# Altium schematic sheet ADC_PLL.SchDoc: FIT_PM12 board
size 420 x 297 mm; CheckedBy: G.Kasprowicz; Author: INR Moscow; CompanyName: WUT ISE; DrawnBy: M.Podgórski; Organization: WUT ISE; Address1: PW ISE; Address2: Nowowiejska 15/19 00-665 Warsaw; Address3: gkasprow@gmail.com; DocumentNumber: 6; Revision: 2; SheetNumber: 7; SheetTotal: 21; ModifiedBy: -; CheckedDate: -; Title2: ADC clocking; DivGrp: WUT ISE; Designer: INR RAS; ModifiedDate: -; ProjectName: Sensor Box
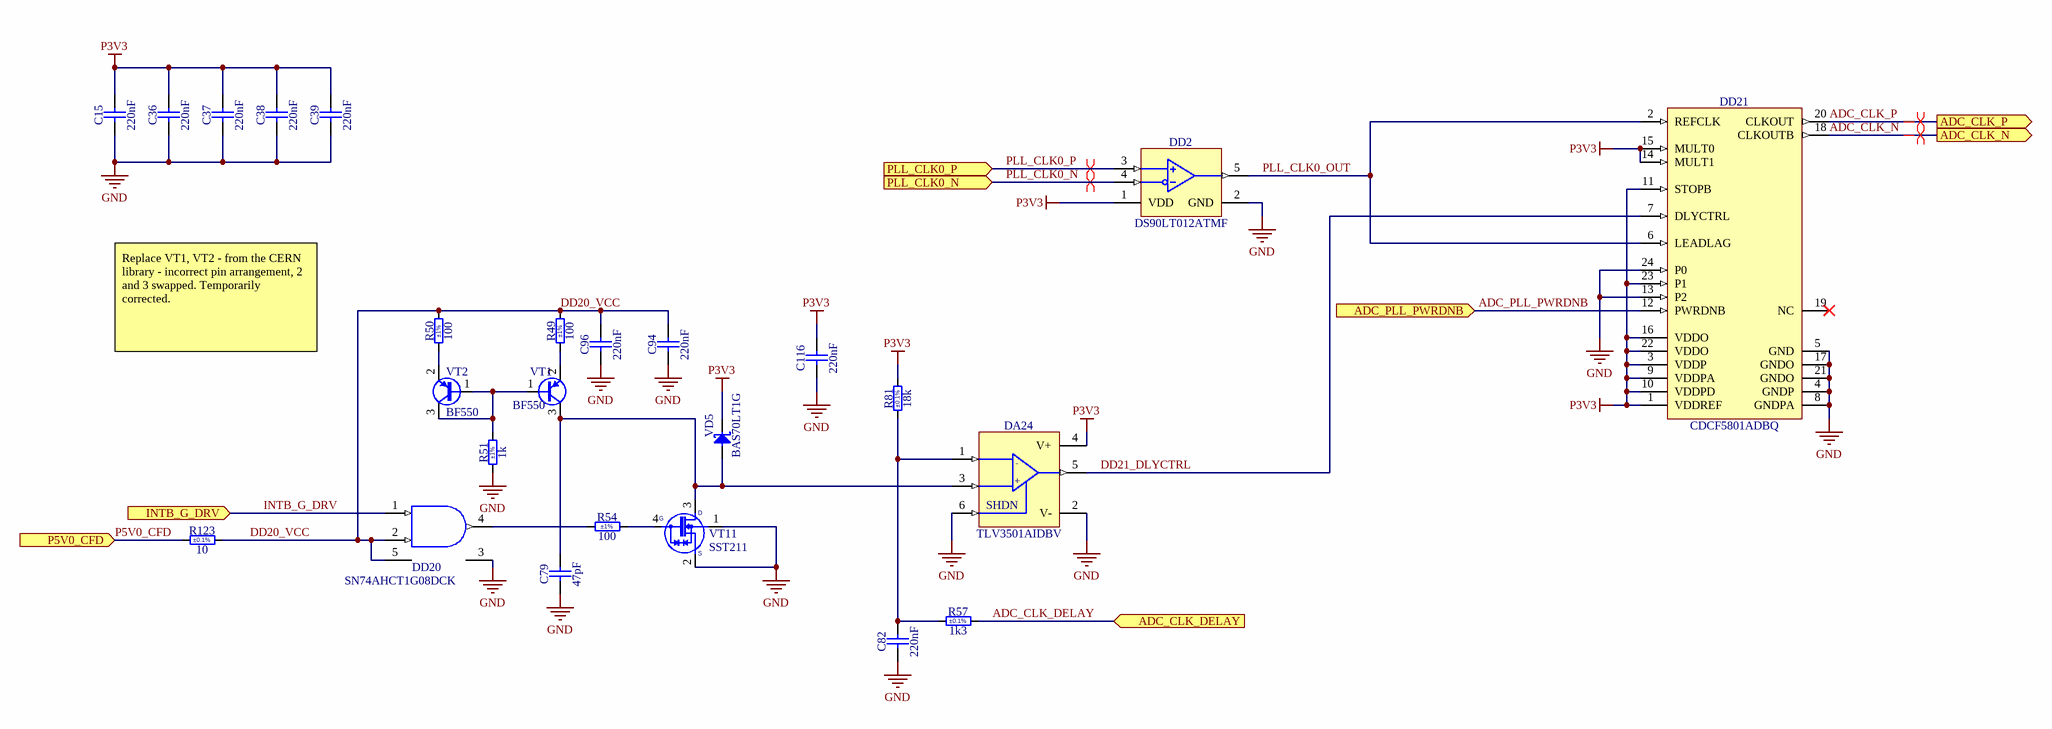
[diagram p0: ADC_PLL.SchDoc]

## Parts
C15  220nF  [CAPC1005X55N]
C36  220nF  [CAPC1005X55N]
C37  220nF  [CAPC1005X55N]
C38  220nF  [CAPC1005X55N]
C39  220nF  [CAPC1005X55N]
C79  47pF  [CAPC2012X140N]
C82  220nF  [CAPC1005X55N]
C94  220nF  [CAPC1005X55N]
C96  220nF  [CAPC1005X55N]
C116  220nF  [CAPC2012X135N]
DA24  TLV3501AIDBV  [SOT95P280X145-6N]
DD2  DS90LT012ATMF  [SOT95P280X145-5N]
DD20  SN74AHCT1G08DCK  [SOT65P210X110-5N]
DD21  CDCF5801ADBQ  [SOP63P600X175-24N]
R49  100  Tolerance: ±1%  [RESC1608X55N]
R50  100  Tolerance: ±1%  [RESC1608X55N]
R51  1k  Tolerance: ±1%  [RESC1005X40N]
R54  100  Tolerance: ±1%  [RESC1608X55N]
R57  1k3  Tolerance: ±0.1%  [RESC2012X60N]
R81  18k  Tolerance: ±0.1%  [RESC2012X60N]
R123  10  Tolerance: ±0.1%  [RESC2012X60N]
VD5  BAS70LT1G  [SOT95P240X110-3N]
VT1  BF550  [SOT95P230X110-3N]
VT2  BF550  [SOT95P230X110-3N]
VT11  SST211  [SOT143N]

## Ports
ADC_CLK_DELAY (in), ADC_CLK_N (out), ADC_CLK_P (out), ADC_PLL_PWRDNB (in), INTB_G_DRV (in), P5V0_CFD (in), PLL_CLK0_N (in), PLL_CLK0_P (in)

## Nets
GND: C15.1 C36.1 C37.1 C38.1 C39.1 C79.1 C82.1 C94.1 C96.1 C116.1 DA24.2(V-) DA24.6(SHDN) DD2.2(GND) DD20.3(GND) DD21.4(GNDP) DD21.5(GND) DD21.8(GNDPA) DD21.13(P2) DD21.17(GNDO) DD21.21(GNDO) DD21.24(P0) R51.1 VT11.1(SUB) VT11.2(S)
P3V3: C15.2 C36.2 C37.2 C38.2 C39.2 C116.2 DA24.4(V+) DD2.1(VDD) DD21.1(VDDREF) DD21.3(VDDP) DD21.9(VDDPA) DD21.10(VDDPD) DD21.11(STOPB) DD21.14(MULT1) DD21.15(MULT0) DD21.16(VDDO) DD21.22(VDDO) DD21.23(P1) R81.2 VD5.3(C)
ADC_CLK_DELAY: R57.2 ; port ADC_CLK_DELAY
ADC_CLK_N: DD21.18(CLKOUTB) ; port ADC_CLK_N
ADC_CLK_P: DD21.20(CLKOUT) ; port ADC_CLK_P
ADC_PLL_PWRDNB: DD21.12(PWRDNB) ; port ADC_PLL_PWRDNB
DD20_VCC: C94.2 C96.2 DD20.2(A) DD20.5(VCC) R49.2 R50.2 R123.2
DD21_DLYCTRL: DA24.5(OUT) DD21.7(DLYCTRL)
INTB_G_DRV: DD20.1(B) ; port INTB_G_DRV
P5V0_CFD: R123.1 ; port P5V0_CFD
PLL_CLK0_N: DD2.4(IN-) ; port PLL_CLK0_N
PLL_CLK0_OUT: DD2.5(TTLOUT) DD21.2(REFCLK) DD21.6(LEADLAG)
PLL_CLK0_P: DD2.3(IN+) ; port PLL_CLK0_P
NetC79_2: C79.2 DA24.3(+IN) VD5.1(A) VT1.3(E) VT11.3(D)
NetC82_2: C82.2 DA24.1(-IN) R57.1 R81.1
NetDD20_4: DD20.4(Y) R54.1
NetR49_1: R49.1 VT1.2(C)
NetR50_1: R50.1 VT2.2(C)
NetR51_2: R51.2 VT1.1(B) VT2.1(B) VT2.3(E)
NetR54_2: R54.2 VT11.4(G)

Not connected (* = marked no-connect by the designer): DD21 19(NC)*

## Layout directives
differential pair: ADC_CLK_N, ADC_CLK_P, PLL_CLK0_N, PLL_CLK0_P

## Notes on the sheet
- Replace VT1, VT2 - from the CERN library - incorrect pin arrangement, 2 and 3 swapped. Temporarily corrected.
- Project/Equipment
- Document
- Designer
- Drawn by
- Check.by
- Copyright WUT ISE 2024.
  This documentation describes Open Hardware and is licensed under the CERN OHL-W v.2.0. You may redistribute and modify this documentation under the terms of the CERN OHL-W v.2.0. (http://ohwr.org/CERNOHL). This documentation is distributed WITHOUT ANY EXPRESS OR IMPLIED WARRANTY, INCLUDING OF MERCHANTABILITY, SATISFACTORY QUALITY AND FITNESS FOR A PARTICULAR PURPOSE. Please see the CERN OHL v.2.0 for applicable conditions.
- Contact
- File
- Last Mod.
- Print Date
- Sheet
- Size
- A3
- of
- Rev
- (in symbol TLV3501AIDBV) -; +

## Library data of the parts
C15 C36-C39 C82 C94 C96 = CC0402_220NF_16V_10%_X7R: Non-polarised capacitor; Part Description: SMD Multilayer Chip Ceramic Capacitor; Manufacturer: GENERIC; Manufacturer1 Part Number: C1005X7R1C224K050; Voltage: 16V; TC: X7R; Tolerance: ±10%; Part Number: CC0402_220NF_16V_10%_X7R; Component Kind: Standard; Component Type: Standard; Pin Count: 2; Value: 220nF; Status: Preferred; Manufacturer Part Number: CC0402_220NF_16V_10%_X7R; Case: 0402; Mounted: Yes; Socket: No; SMD: Yes; Sense: No; Manufacturer1 Example: TDK; Manufacturer1 ComponentHeight: 0.55mm; HelpURL: \\cern.ch\dfs\Applications\Altium\Datasheets\CC0402_X7R_TDK_C.pdf; Author: CERN DEM JLC; CreateDate: 25.10.2012; LatestRevisionDate: 25.10.2012
C79 = CC0805_47pF_50V_2%_X8R: Non-polarised capacitor; Part Description: SMD Multilayer Chip Ceramic Capacitor (Automotive Grade); Manufacturer: KEMET; Manufacturer Part Number: C0805C470G5HACAUTO; Voltage: 50V; TC: X8R; Tolerance: ±2%; Part Number: CC0805_47pF_50V_2%_X8R; Component Kind: Standard; Component Type: Standard; Pin Count: 2; Value: 47pF; Status: Not Recommended; Case: 0805; Mounted: Yes; Socket: No; SMD: Yes; Sense: No; ComponentHeight: 1.4mm; HelpURL: \\cern.ch\dfs\Applications\Altium\Datasheets\CC0805_X8R_KEMET.pdf; Author: CERN DEM HF; CreateDate: 07.05.2024; LatestRevisionDate: 07.05.2024
C116 = CC0805_220NF_50V_10%_X7R: Non-polarised capacitor; Part Description: SMD Multilayer Chip Ceramic Capacitor; Manufacturer: GENERIC; Manufacturer1 Part Number: GRM21BR71H224KA01L; Voltage: 50V; TC: X7R; Tolerance: ±10%; Part Number: CC0805_220NF_50V_10%_X7R; Component Kind: Standard; Component Type: Standard; Pin Count: 2; Value: 220nF; Status: Preferred; Manufacturer Part Number: CC0805_220NF_50V_10%_X7R; Case: 0805; Mounted: Yes; Socket: No; SMD: Yes; Sense: No; Manufacturer1 Example: MURATA; Manufacturer1 ComponentHeight: 1.35mm; HelpURL: \\cern.ch\dfs\Applications\Altium\Datasheets\CC0805_X7R_MURATA.pdf; Author: CERN DEM JLC; CreateDate: 03.12.2007; LatestRevisionDate: 03.12.2007
DA24 = TLV3501AIDBV: Wideband, Fixed Gain, Video Buffer Amplifier With Disable; Part Description: 4.5-ns, Rail-to-Rail, High-Speed Comparator; Manufacturer: TEXAS INSTRUMENTS; PressFit: No; Bonding: No; Part Number: TLV3501AIDBV; Component Kind: Standard; Component Type: Standard; Device: TLV3501AIDBV; PackageDescription: SOT, 0.95mm Pitch; 6 Pin, 1.60mm W X 2.90mm L X 1.45mm H body, IPC Medium Density; Manufacturer Part Number: TLV3501AIDBV; Pin Count: 6; Case: SOT23-6; Mounted: Yes; Socket: No; SMD: Yes; Sense: No; ComponentHeight: 1.45mm; Author: CERN DEM HF; HelpURL: \\cern.ch\dfs\Applications\Altium\Datasheets\TLV3501.pdf; CreateDate: 17.05.2024; LatestRevisionDate: 17.05.2024
DD2 = DS90LT012ATMF: 3V LVDS Single CMOS Differential Line Receiver; Manufacturer: TEXAS INSTRUMENTS; PressFit: No; Bonding: No; Part Number: DS90LT012ATMF; Component Kind: Standard; Component Type: Standard; Device: DS90LT012ATMF; PackageDescription: SOT, 0.95mm Pitch; 5 Pin, 1.60mm W X 2.90mm L X 1.45mm H body, IPC Medium Density; Part Description: 3V LVDS Single CMOS Differential Line Receiver; Manufacturer Part Number: DS90LT012ATMF; Pin Count: 5; Case: SOT23-5; Mounted: Yes; Socket: No; SMD: Yes; Sense: No; ComponentHeight: 1.45mm; Author: CERN DEM HF; HelpURL: \\cern.ch\dfs\Applications\Altium\Datasheets\DS90LT012ATMF.pdf; CreateDate: 08.05.2024; LatestRevisionDate: 08.05.2024
DD20 = SN74AHCT1G08DCK: Single 2-Input AND Gate; Part Description: Single 2-Input Positive-AND Gate; Manufacturer: TEXAS INSTRUMENTS; PressFit: No; Bonding: No; Part Number: SN74AHCT1G08DCK; Component Kind: Standard; Component Type: Standard; Device: SN74AHCT1G08DCK; PackageDescription: SOT353, SC70-5, 0.65mm Pitch; 5 Pin, 1.25mm W X 2.00mm L X 1.10mm H body, IPC Medium Density; Manufacturer Part Number: SN74AHCT1G08DCK; Pin Count: 5; Case: SOT353; Mounted: Yes; Socket: No; SMD: Yes; Sense: No; ComponentHeight: 1.1mm; Author: CERN DEM HF; HelpURL: \\cern.ch\dfs\Applications\Altium\Datasheets\NC7SZ08.pdf; CreateDate: 17.05.2024; LatestRevisionDate: 17.05.2024
DD21 = CDCF5801ADBQ: Clock Multiplier with Delay Control and Phase Alignment; Manufacturer: TEXAS INSTRUMENTS; PressFit: No; Bonding: No; Part Number: CDCF5801ADBQ; Component Kind: Standard; Component Type: Standard; Device: CDCF5801ADBQ; PackageDescription: SOP, 0.635mm Pitch; 24 Pin, 3.90mm W X 8.65mm L X 1.75mm H Body, IPC Medium Density; Part Description: Clock Multiplier with Delay Control and Phase Alignment; Manufacturer Part Number: CDCF5801ADBQ; Pin Count: 24; Case: SSOP24; Mounted: Yes; Socket: No; SMD: Yes; Sense: No; ComponentHeight: 1.75mm; HelpURL: \\cern.ch\dfs\Applications\Altium\Datasheets\CDCF5801A.pdf; Author: CERN DEM HF; CreateDate: 07.05.2024; LatestRevisionDate: 07.05.2024
R49 R50 R54 = R0603_100R_1%_0.1W_100PPM: Resistor - 1%; Part Description: General Purpose Thick Film Chip Resistor; Manufacturer: GENERIC; Manufacturer1 Part Number: NRC06F4700TRF; Power: 0.1W; TC: ±100ppm/°C; PressFit: No; Part Number: R0603_100R_1%_0.1W_100PPM; Component Kind: Standard; Component Type: Standard; Pin Count: 2; Value: 100; Status: Preferred; Manufacturer Part Number: R0603_100R_1%_0.1W_100PPM; Case: 0603; Mounted: Yes; Sense: No; Socket: No; SMD: Yes; Manufacturer1 Example: NIC COMPONENT; Manufacturer1 ComponentHeight: 0.55mm; HelpURL: \\cern.ch\dfs\Applications\Altium\Datasheets\R0603_NIC_NRC.pdf; Author: CERN DEM JLC; CreateDate: 03.12.2007; LatestRevisionDate: 13.03.2008
R51 = R0402_1K_1%_0.0625W_100PPM: Resistor - 1%; Part Description: General Purpose Thick Film Chip Resistor; Manufacturer: GENERIC; Manufacturer1 Part Number: 232270671002L; TC: ±100ppm/°C; PressFit: No; Part Number: R0402_1K_1%_0.0625W_100PPM; Component Kind: Standard; Component Type: Standard; Pin Count: 2; Value: 1k; Status: Not Recommended; Power: 0.0625W; Manufacturer Part Number: R0402_1K_1%_0.0625W_100PPM; Case: 0402; Mounted: Yes; Sense: No; Socket: No; SMD: Yes; Manufacturer1 Example: YAGEO PHYCOMP; Manufacturer1 ComponentHeight: 0.4mm; HelpURL: \\cern.ch\dfs\Applications\Altium\Datasheets\R0402_Phycomp_RC0402.pdf; Author: CERN DEM JLC; CreateDate: 03.12.2007; LatestRevisionDate: 17.10.2012
R57 = R0805_1K3_0.1%_0.1W_10PPM: Resistor - 0.1%; Part Description: Thin Film Chip Resistor; Manufacturer: GENERIC; Manufacturer1 Part Number: RN73C2A1K3BTG; Power: 0.1W; TC: ±10ppm; PressFit: No; Part Number: R0805_1K3_0.1%_0.1W_10PPM; Component Kind: Standard; Component Type: Standard; Pin Count: 2; Value: 1k3; Status: Not Recommended; Manufacturer Part Number: R0805_1K3_0.1%_0.1W_10PPM; Case: 0805; Mounted: Yes; Sense: No; Socket: No; SMD: Yes; Manufacturer1 Example: TYCO HOLSWORTHY; Manufacturer1 ComponentHeight: 0.6mm; HelpURL: \\cern.ch\dfs\Applications\Altium\Datasheets\R0805_Tyco_RN73.pdf; Author: CERN DEM JLC; CreateDate: 03.12.2007; LatestRevisionDate: 13.03.2008
R81 = R0805_18K_0.1%_0.125W_10PPM: Resistor - 0.1%; Part Description: Thin Film Chip Resistor; Manufacturer: GENERIC; Manufacturer1 Part Number: ERA6ARB183V; Power: 0.125W; TC: ±10ppm; PressFit: No; Part Number: R0805_18K_0.1%_0.125W_10PPM; Component Kind: Standard; Component Type: Standard; Pin Count: 2; Value: 18k; Status: Not Recommended; Manufacturer Part Number: R0805_18K_0.1%_0.125W_10PPM; Case: 0805; Mounted: Yes; Sense: No; Socket: No; SMD: Yes; Manufacturer1 Example: PANASONIC; Manufacturer1 ComponentHeight: 0.6mm; HelpURL: \\cern.ch\dfs\Applications\Altium\Datasheets\R0805_PANASONIC_ERA.pdf; Author: CERN DEM HF; CreateDate: 17.05.2024; LatestRevisionDate: 17.05.2024
R123 = R0805_10R_0.1%_0.1W_10PPM: Resistor - 0.1%; Part Description: Thin Film Chip Resistor; Manufacturer: GENERIC; Manufacturer1 Part Number: RN73C2A10RBTG; Power: 0.1W; TC: ±10ppm; PressFit: No; Part Number: R0805_10R_0.1%_0.1W_10PPM; Component Kind: Standard; Component Type: Standard; Pin Count: 2; Value: 10; Status: Not Recommended; Manufacturer Part Number: R0805_10R_0.1%_0.1W_10PPM; Case: 0805; Mounted: Yes; Sense: No; Socket: No; SMD: Yes; Manufacturer1 Example: TYCO HOLSWORTHY; Manufacturer1 ComponentHeight: 0.6mm; HelpURL: \\cern.ch\dfs\Applications\Altium\Datasheets\R0805_Tyco_RN73.pdf; Author: CERN DEM JLC; CreateDate: 03.12.2007; LatestRevisionDate: 13.03.2008
VD5 = BAS70LT1G: Diode Schottky  Anode Pin 1 Cathode Pin 3 (Pas de pin 2); Part Description: Schottky Barrier Diode; Manufacturer: ON SEMICONDUCTOR; Manufacturer Part Number: BAS70L; Voltage: 70V; Power: 70mA; PressFit: No; Bonding: No; Part Number: BAS70LT1G; Component Kind: Standard; Component Type: Standard; Device: BAS70LT1G; PackageDescription: SOT, 0.95mm Pitch; 3 Pin, 1.30mm W X 2.90mm L X 1.10mm H body, IPC Medium Density; Pin Count: 3; Case: SOT23-3; Mounted: Yes; Socket: No; SMD: Yes; Sense: No; ComponentHeight: 1.1mm; HelpURL: \\cern.ch\dfs\Applications\Altium\Datasheets\BAS70LT1G.pdf; Author: CERN DEM JLC; CreateDate: 11.09.2018; LatestRevisionDate: 24.05.2022
VT1 VT2 = BF550: PNP Transistor; Part Description: 40V 25mA PNP Medium Frequency Transistor; Manufacturer: NXP SEMICONDUCTORS; PressFit: No; Bonding: No; Part Number: BF550; Component Kind: Standard; Component Type: Standard; Device: BF550; PackageDescription: SOT23, 0.95mm Pitch; 3 Pin, 1.30mm W X 2.90mm L X 1.10mm H body, IPC Medium Density; Manufacturer Part Number: BF550; Pin Count: 3; Case: SOT23-3; Mounted: Yes; Socket: No; SMD: Yes; Sense: No; ComponentHeight: 1.1mm; HelpURL: \\cern.ch\dfs\Applications\Altium\Datasheets\BF550.pdf; Author: CERN DEM HF; CreateDate: 06.05.2024; LatestRevisionDate: 06.05.2024
VT11 = SST211: 30V, 50 mA N-Channel Enhancement Switching Transistor; Part Description: 30V, 50mA, N-Channel Enhancement Switching Transistor; Manufacturer: Linear Systems; PressFit: No; Bonding: No; Part Number: SST211; Component Kind: Standard; Component Type: Standard; Device: SST211; PackageDescription: SOT143, 4-Leads, Body 3.0x2.6mm (max), Pitch 1.92mm, IPC Medium Density; Status: Obsolete; Manufacturer Part Number: SST211; Pin Count: 4; Case: SOT143; Mounted: Yes; Socket: No; SMD: Yes; Sense: No; ComponentHeight: 1.3mm; HelpURL: \\cern.ch\dfs\Applications\Altium\Datasheets\BSS83,215.pdf; Author: CERN DEM JLC; CreateDate: 01.07.2014; LatestRevisionDate: 17.05.2016